# Altium project MD2084-R3M2E2.PrjPcb (part 3 of 3)

## Sheet RGB_CCM.SchDoc: =project_title
size Tabloid; PageSetup: Record=PageOptions|CenterHorizontal=True|CenterVertical=True|PrintScale=0.71|XCorrection=1.00|YCorrection=1.00|PrintKind=0|BorderSize=5000000|LeftOffset=0|BottomOffset=0|Orientation=2|PaperLength=1000|PaperWidth=1000|Scale=100|PaperSource=7|PrintQuality=-4|MediaType=1|DitherType=10|PrintScaleMode=1|PaperKind=A4; CompanyName: Luxonis Holding; DrawnBy: Martin Debevc; Organization: Luxonis Holding; Address1: 1925 Harmony Park Drive; Address2: Westminster, CO; Address3: 80234; Address4: United States; DocumentNumber: D2088000; Revision: R3M2E2; SheetNumber: 12; SheetTotal: 13
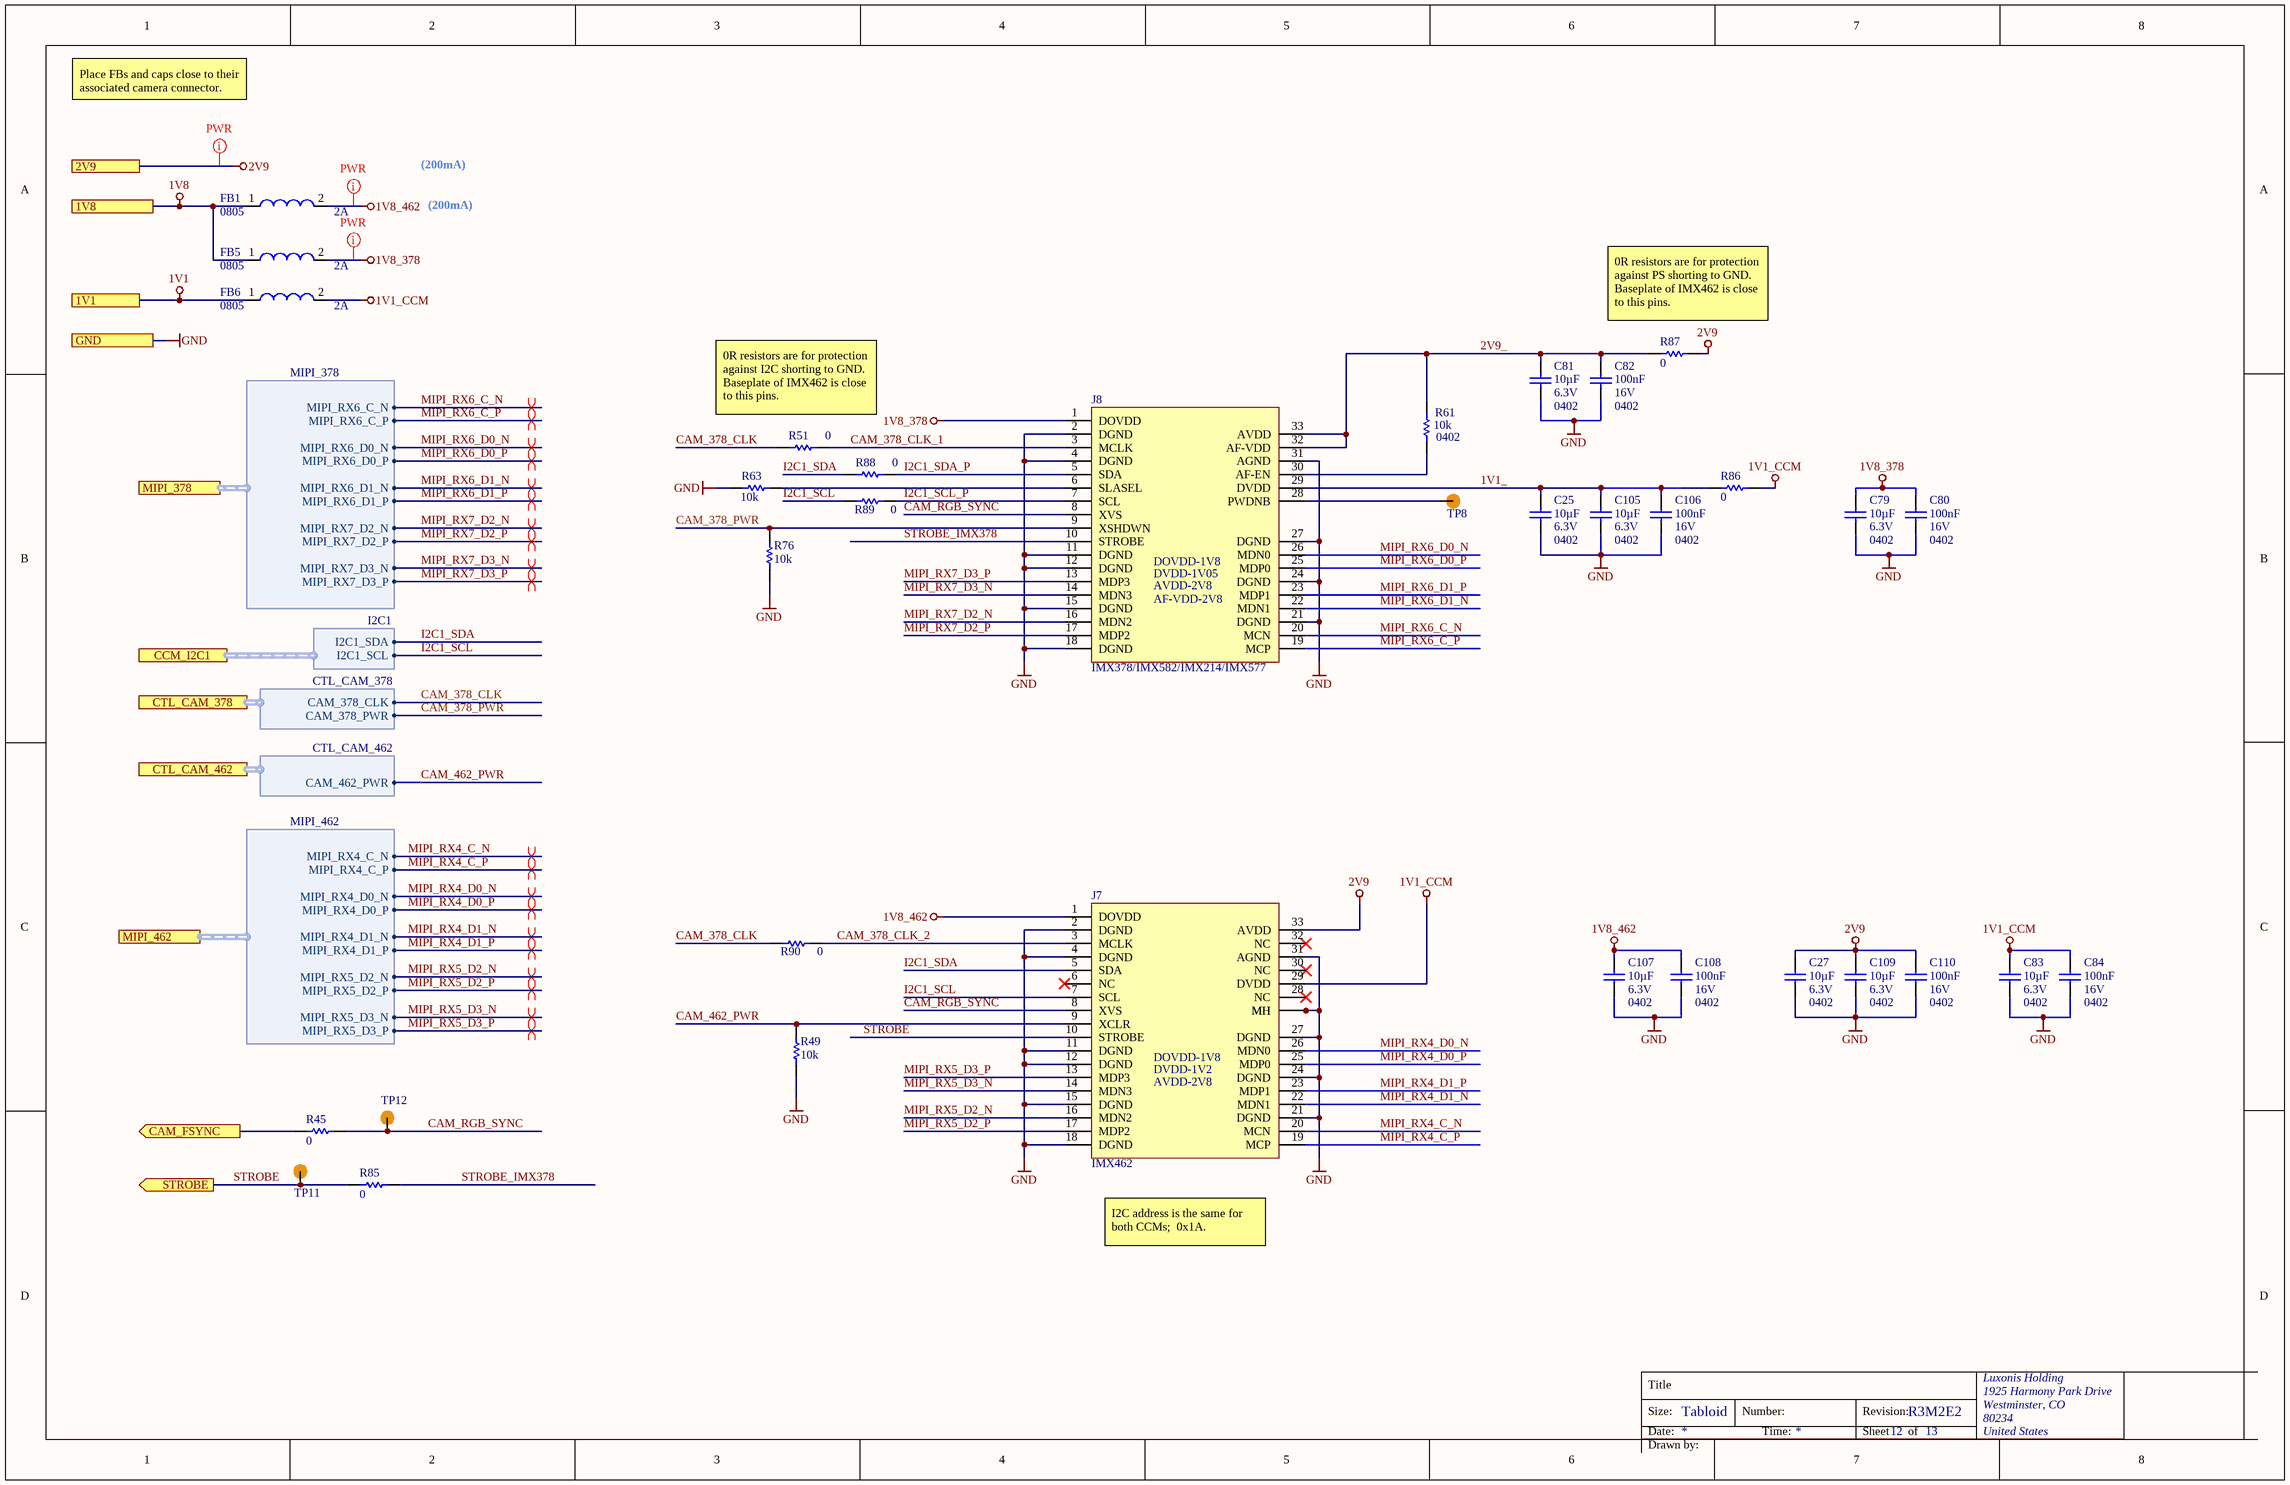
[diagram p10: RGB_CCM.SchDoc]

### Parts
C25  value 10µF  Voltage Rating: 6.3V  Case/Package: 0402  [CAPC0402(1005)70_L]  (hidden comment: GRM155R60J106ME15D)
C27  value 10µF  Voltage Rating: 6.3V  Case/Package: 0402  [CAPC0402(1005)70_L]  (hidden comment: GRM155R60J106ME15D)
C79  value 10µF  Voltage Rating: 6.3V  Case/Package: 0402  [CAPC0402(1005)70_L]  (hidden comment: GRM155R60J106ME15D)
C80  value 100nF  Voltage Rating: 16V  Case/Package: 0402  [CAPC0402(1005)60_L]  (hidden comment: CL05B104KO5NFNC)
C81  value 10µF  Voltage Rating: 6.3V  Case/Package: 0402  [CAPC0402(1005)70_L]  (hidden comment: GRM155R60J106ME15D)
C82  value 100nF  Voltage Rating: 16V  Case/Package: 0402  [CAPC0402(1005)60_L]  (hidden comment: CL05B104KO5NFNC)
C83  value 10µF  Voltage Rating: 6.3V  Case/Package: 0402  [CAPC0402(1005)70_L]  (hidden comment: GRM155R60J106ME15D)
C84  value 100nF  Voltage Rating: 16V  Case/Package: 0402  [CAPC0402(1005)60_L]  (hidden comment: CL05B104KO5NFNC)
C105  value 10µF  Voltage Rating: 6.3V  Case/Package: 0402  [CAPC0402(1005)70_L]  (hidden comment: GRM155R60J106ME15D)
C106  value 100nF  Voltage Rating: 16V  Case/Package: 0402  [CAPC0402(1005)60_L]  (hidden comment: CL05B104KO5NFNC)
C107  value 10µF  Voltage Rating: 6.3V  Case/Package: 0402  [CAPC0402(1005)70_L]  (hidden comment: GRM155R60J106ME15D)
C108  value 100nF  Voltage Rating: 16V  Case/Package: 0402  [CAPC0402(1005)60_L]  (hidden comment: CL05B104KO5NFNC)
C109  value 10µF  Voltage Rating: 6.3V  Case/Package: 0402  [CAPC0402(1005)70_L]  (hidden comment: GRM155R60J106ME15D)
C110  value 100nF  Voltage Rating: 16V  Case/Package: 0402  [CAPC0402(1005)60_L]  (hidden comment: CL05B104KO5NFNC)
FB1  Current Rating: 2A  Case/Package: 0805  [2508056017Y2]  (hidden comment: 2508056017Y2)
FB5  Current Rating: 2A  Case/Package: 0805  [2508056017Y2]  (hidden comment: 2508056017Y2)
FB6  Current Rating: 2A  Case/Package: 0805  [2508056017Y2]  (hidden comment: 2508056017Y2)
J7  IMX462  [AC_PY154-IMX462_CON]
J8  IMX378/IMX582/IMX214/IMX577  [PY004]
R45  0  [RESC0402(1005)_L]
R49  value 10k  [RESC0402(1005)_N]  (hidden comment: RC0402FR-1310KL)
R51  0  [RESC0402(1005)_L]
R61  value 10k  Case/Package: 0402  [RESC0402(1005)_N]  (hidden comment: RC0402FR-1310KL)
R63  value 10k  [RESC0402(1005)_N]  (hidden comment: RC0402FR-1310KL)
R76  value 10k  [RESC0402(1005)_N]  (hidden comment: RC0402FR-1310KL)
R85  0  [RESC0402(1005)_L]
R86  0  [RESC0402(1005)_L]
R87  0  [RESC0402(1005)_L]
R88  0  [RESC0402(1005)_L]
R89  0  [RESC0402(1005)_L]
R90  0  [RESC0402(1005)_L]
TP8  TEST_POINT  [TP075_150_NS]  (value not drawn)  (no BOM)
TP11  TEST_POINT  [TP075_150_NS]  (value not drawn)  (no BOM)
TP12  TEST_POINT  [TP075_150_NS]  (value not drawn)  (no BOM)

### Ports
1V1, 1V8, 2V9, CAM_FSYNC (out), CCM_I2C1 (harness I2C1), CTL_CAM_378 (harness CTL_CAM_378), CTL_CAM_462 (harness CTL_CAM_462), GND, MIPI_378 (harness MIPI_378), MIPI_462 (harness MIPI_462), STROBE (out)

### Harnesses
I2C1: I2C1_SDA, I2C1_SCL
CTL_CAM_462: CAM_462_PWR
CTL_CAM_378: CAM_378_CLK, CAM_378_PWR
MIPI_462: MIPI_RX4_C_N, MIPI_RX4_C_P, MIPI_RX4_D0_N, MIPI_RX4_D0_P, MIPI_RX4_D1_N, MIPI_RX4_D1_P, MIPI_RX5_D2_N, MIPI_RX5_D2_P, MIPI_RX5_D3_N, MIPI_RX5_D3_P
MIPI_378: MIPI_RX6_C_N, MIPI_RX6_C_P, MIPI_RX6_D0_N, MIPI_RX6_D0_P, MIPI_RX6_D1_N, MIPI_RX6_D1_P, MIPI_RX7_D2_N, MIPI_RX7_D2_P, MIPI_RX7_D3_N, MIPI_RX7_D3_P

### Nets
1V1: FB6.1 ; port 1V1
1V1_CCM: C83.2 C84.2 FB6.2 J7.29(DVDD) R86.1
1V8: FB1.1 FB5.1 ; port 1V8
1V8_378: C79.2 C80.2 FB5.2 J8.1(DOVDD)
1V8_462: C107.2 C108.2 FB1.2 J7.1(DOVDD)
2V9: C27.2 C109.2 C110.2 J7.33(AVDD) R87.1 ; port 2V9
GND: C25.1 C27.1 C79.1 C80.1 C81.1 C82.1 C83.1 C84.1 C105.1 C106.1 C107.1 C108.1 C109.1 C110.1 J7.2(DGND) J7.4(DGND) J7.11(DGND) J7.12(DGND) J7.15(DGND) J7.18(DGND) J7.21(DGND) J7.24(DGND) J7.27(DGND) J7.31(AGND) J7.34(MH) J7.35(MH) J8.2(DGND) J8.4(DGND) J8.11(DGND) J8.12(DGND) J8.15(DGND) J8.18(DGND) J8.21(DGND) J8.24(DGND) J8.27(DGND) J8.31(AGND) R49.2 R63.2 R76.2 ; port GND
1V1_: C25.2 C105.2 C106.2 J8.29(DVDD) R86.2
2V9_: C81.2 C82.2 J8.32(AF-VDD) J8.33(AVDD) R61.2 R87.2
CAM_378_CLK: R51.2 R90.2 ; port CTL_CAM_378.CAM_378_CLK
CAM_378_CLK_1: J8.3(MCLK) R51.1
CAM_378_CLK_2: J7.3(MCLK) R90.1
CAM_378_PWR: J8.9(XSHDWN) R76.1 ; port CTL_CAM_378.CAM_378_PWR
CAM_462_PWR: J7.9(XCLR) R49.1 ; port CTL_CAM_462.CAM_462_PWR
CAM_FSYNC: R45.2 ; port CAM_FSYNC
CAM_RGB_SYNC: J7.8(XVS) J8.8(XVS) R45.1 TP12.1
I2C1_SCL: J7.7(SCL) R89.2 ; port CCM_I2C1.I2C1_SCL
I2C1_SCL_P: J8.7(SCL) R89.1
I2C1_SDA: J7.5(SDA) R88.2 ; port CCM_I2C1.I2C1_SDA
I2C1_SDA_P: J8.5(SDA) R88.1
MIPI_RX4_C_N: J7.20(MCN) ; port MIPI_462.MIPI_RX4_C_N
MIPI_RX4_C_P: J7.19(MCP) ; port MIPI_462.MIPI_RX4_C_P
MIPI_RX4_D0_N: J7.26(MDN0) ; port MIPI_462.MIPI_RX4_D0_N
MIPI_RX4_D0_P: J7.25(MDP0) ; port MIPI_462.MIPI_RX4_D0_P
MIPI_RX4_D1_N: J7.22(MDN1) ; port MIPI_462.MIPI_RX4_D1_N
MIPI_RX4_D1_P: J7.23(MDP1) ; port MIPI_462.MIPI_RX4_D1_P
MIPI_RX5_D2_N: J7.16(MDN2) ; port MIPI_462.MIPI_RX5_D2_N
MIPI_RX5_D2_P: J7.17(MDP2) ; port MIPI_462.MIPI_RX5_D2_P
MIPI_RX5_D3_N: J7.14(MDN3) ; port MIPI_462.MIPI_RX5_D3_N
MIPI_RX5_D3_P: J7.13(MDP3) ; port MIPI_462.MIPI_RX5_D3_P
MIPI_RX6_C_N: J8.20(MCN) ; port MIPI_378.MIPI_RX6_C_N
MIPI_RX6_C_P: J8.19(MCP) ; port MIPI_378.MIPI_RX6_C_P
MIPI_RX6_D0_N: J8.26(MDN0) ; port MIPI_378.MIPI_RX6_D0_N
MIPI_RX6_D0_P: J8.25(MDP0) ; port MIPI_378.MIPI_RX6_D0_P
MIPI_RX6_D1_N: J8.22(MDN1) ; port MIPI_378.MIPI_RX6_D1_N
MIPI_RX6_D1_P: J8.23(MDP1) ; port MIPI_378.MIPI_RX6_D1_P
MIPI_RX7_D2_N: J8.16(MDN2) ; port MIPI_378.MIPI_RX7_D2_N
MIPI_RX7_D2_P: J8.17(MDP2) ; port MIPI_378.MIPI_RX7_D2_P
MIPI_RX7_D3_N: J8.14(MDN3) ; port MIPI_378.MIPI_RX7_D3_N
MIPI_RX7_D3_P: J8.13(MDP3) ; port MIPI_378.MIPI_RX7_D3_P
STROBE: J7.10(STROBE) R85.2 TP11.1 ; port STROBE
STROBE_IMX378: J8.10(STROBE) R85.1
NetJ8_6: J8.6(SLASEL) R63.1
NetJ8_28: J8.28(PWDNB) TP8.1
NetJ8_30: J8.30(AF-EN) R61.1

Not connected (* = marked no-connect by the designer): J7 6(NC)* 28(NC)* 30(NC)* 32(NC)*

### Layout directives
net class PWR; Current Rating: 200mA: 1V8_378, 1V8_462, 2V9
differential pair; differential pair class 100ohm: MIPI_RX4_C_N, MIPI_RX4_C_P, MIPI_RX4_D0_N, MIPI_RX4_D0_P, MIPI_RX4_D1_N, MIPI_RX4_D1_P, MIPI_RX5_D2_N, MIPI_RX5_D2_P, MIPI_RX5_D3_N, MIPI_RX5_D3_P, MIPI_RX6_C_N, MIPI_RX6_C_P, MIPI_RX6_D0_N, MIPI_RX6_D0_P, MIPI_RX6_D1_N, MIPI_RX6_D1_P, MIPI_RX7_D2_N, MIPI_RX7_D2_P, MIPI_RX7_D3_N, MIPI_RX7_D3_P

### Notes on the sheet
- Place FBs and caps close to their associated camera connector.
- (200mA)
- 0R resistors are for protection against PS shorting to GND. Baseplate of IMX462 is close to this pins.
- (near R51) 0R resistors are for protection against I2C shorting to GND. Baseplate of IMX462 is close to this pins.
- (near J8) (1V8)
- (near J8) (2V8)
- (near J8) (1V8 Level)
- I2C address is the same for both CCMs;  0x1A.
- Title
- Size:
- Date:
- Tabloid
- Number:
- Time:
- Revision:
- Sheet
- of
- Drawn by:
- (in symbol CMP-002-00191-10) DOVDD-1V8; DVDD-1V2; AVDD-2V8
- (in symbol CMP-005-000037-17) DOVDD-1V8; DVDD-1V05; AVDD-2V8; AF-VDD-2V8

### Library data of the parts
C25 C27 C79 C81 C83 C105 C107 C109 = CMP-004-000009-5: CAP CER 10UF 6.3V X5R 0402 20%; Manufacturer 1: Murata; Dielectric: X5R; Manufacturer Part Number 1: GRM155R60J106ME15D; ComponentLink1URL: https://www.murata.com/~/media/webrenewal/support/library/catalog/products/capacitor/mlcc/c02e.ashx?la=en-us&src-supplier=Digi-Key; Design Item ID: GRM155R60J106ME15D; Tolerance: 20%; Width: 0.02inch; Length: 0.039inch; Mounting Technology: SMT; Min Operating Temperature: -55°C; Max Operating Temperature: 85°C; ComponentLink1Description: https://www.murata.com/~/media/webrenewal/support/library/catalog/products/capacitor/mlcc/c02e.ashx?la=en-us&src-supplier=Digi-Key
C80 C82 C84 C106 C108 C110 = CMP-108-000002-6: CAP CER 0.1UF 16V X7R 0402 10%; Manufacturer 1: Samsung; ComponentLink1URL: https://datasheet.ciiva.com/25767/cl05b104ko5nfnc-25767124.pdf?src-supplier=Digi-Key; Length: 1mm; Design Item ID: CL05B104KO5NFNC; Tolerance: 10%; Min Operating Temperature: -55°C; Width: 0.02inch; Dielectric: X7R; ComponentLink1Description: https://datasheet.ciiva.com/25767/cl05b104ko5nfnc-25767124.pdf?src-supplier=Digi-Key; Height: 0.5mm; Depth: 0.5mm; Manufacturer Part Number 1: CL05B104KO5NFNC; Max Operating Temperature: 125°C; Mounting Technology: SMT
FB1 FB5 FB6 = CMP-082-000000-2: FERRITE BEAD, 0.1OHM, 2A, 0805, 600R/100MHz; Manufacturer 1: Fair-Rite; Tolerance: 25%; Manufacturer Part Number 1: 2508056017Y2
J7 = CMP-002-00191-10: FFC/FPC Connector, 33 Contact(s), 1 Row(s), Female, Right Angle, Surface Mount Terminal; Manufacturer Part Number 1: FH26W-33S-0.3SHW(60); Manufacturer 1: Hirose; ComponentLink2Description: https://www.hirose.com/product/en/download_file/key_name/FH26/category/Catalog/doc_file_id/49355/?file_category_id=4&item_id=298&is_series=1&src-supplier=Digi-Key; Pins: 33; ComponentLink3Description: https://www.hirose.com/product/download/?distributor=digikey&amp;type=2d&amp;lang=en&amp;num=FH26W-13S-0.3SHW(60)&src-supplier=Digi-Key; RoHS: Yes; ComponentLink3URL: https://www.hirose.com/product/download/?distributor=digikey&amp;type=2d&amp;lang=en&amp;num=FH26W-13S-0.3SHW(60)&src-supplier=Digi-Key; Source: LuxonisMaster.SchLib; Pricing 1: 1=1,78000, 10=1,61700, 25=1,51800, 50=1,45200, 100=1,38600, 250=1,25400, 500=1,15500, 1000=0,99000, 2500=0,92400 (USD); ComponentLink1Description: https://datasheet.ciiva.com:443/pdfs/VipMasterIC/IC/HIRO/HIRO-S-A0007913874/HIRO-S-A0008593114-1.pdf?src-supplier=IHS+Markit; ComponentLink1URL: https://datasheet.ciiva.com:443/pdfs/VipMasterIC/IC/HIRO/HIRO-S-A0007913874/HIRO-S-A0008593114-1.pdf?src-supplier=IHS+Markit; Category: FFC / FPC; Design Item ID: AC_PY111-IMX577_CON; Stock 1: 627; System: connector; ComponentLink2URL: https://www.hirose.com/product/en/download_file/key_name/FH26/category/Catalog/doc_file_id/49355/?file_category_id=4&item_id=298&is_series=1&src-supplier=Digi-Key
J8 = CMP-005-000037-17: FFC/FPC Connector, 33 Contact(s), 1 Row(s), Female, Right Angle, Surface Mount Terminal; Manufacturer Part Number 1: FH26W-33S-0.3SHW(60); Manufacturer 1: Hirose; ComponentLink3Description: https://www.hirose.com/product/download/?distributor=digikey&amp;type=2d&amp;lang=en&amp;num=FH26W-13S-0.3SHW(60)&src-supplier=Digi-Key; ComponentLink1URL: https://datasheet.ciiva.com:443/pdfs/VipMasterIC/IC/HIRO/HIRO-S-A0007913874/HIRO-S-A0008593114-1.pdf?src-supplier=IHS+Markit; Category: FFC / FPC; ComponentLink2URL: https://www.hirose.com/product/en/download_file/key_name/FH26/category/Catalog/doc_file_id/49355/?file_category_id=4&item_id=298&is_series=1&src-supplier=Digi-Key; ComponentLink1Description: https://datasheet.ciiva.com:443/pdfs/VipMasterIC/IC/HIRO/HIRO-S-A0007913874/HIRO-S-A0008593114-1.pdf?src-supplier=IHS+Markit; Pricing 1: 1=1,78000, 10=1,61700, 25=1,51800, 50=1,45200, 100=1,38600, 250=1,25400, 500=1,15500, 1000=0,99000, 2500=0,92400 (USD); ComponentLink2Description: https://www.hirose.com/product/en/download_file/key_name/FH26/category/Catalog/doc_file_id/49355/?file_category_id=4&item_id=298&is_series=1&src-supplier=Digi-Key; Source: LuxonisMaster.SchLib; Stock 1: 627; Design Item ID: AC_PY004-IMX378_CON; RoHS: Yes; Pins: 33; ComponentLink3URL: https://www.hirose.com/product/download/?distributor=digikey&amp;type=2d&amp;lang=en&amp;num=FH26W-13S-0.3SHW(60)&src-supplier=Digi-Key; System: connector
R45 R51 R85-R90 = CMP-013-000022-11: RES SMD 0 OHM 5% 1/16W 0402; Manufacturer 1: Vishay; Manufacturer Part Number 1: CRCW04020000Z0ED; Power Rating: 63mW; Voltage Rating: 50V; Case/Package: 0402; Min Operating Temperature: -55°C; Max Operating Temperature: 155°C; Tolerance: 5%; Value: 0; Design Item ID: CRCW04020000Z0ED
R49 R61 R63 R76 = CMP-115-000004-8: RES SMD 10K OHM 1% 1/16W 0402; Manufacturer 1: Yageo; Power Rating: 62.5mW; Temperature Coefficient: 100ppm/°C; Voltage Rating: 50V; Min Operating Temperature: -55°C; Max Operating Temperature: 155°C; Design Item ID: RC0402FR-1310KL; Tolerance: 1%; Manufacturer Part Number 1: RC0402FR-1310KL
  R49 R63 R76: Case/Package: 0402
TP8 TP11 TP12 = CMP-015-000000-5: Manufacturer Part Number 1: /; Design Item ID: TEST_POINT; Source: LuxonisMaster.SchLib

## Sheet IMU.SchDoc: =project_title
size Tabloid; CompanyName: Luxonis Holding; DrawnBy: Martin Debevc; Organization: Luxonis Holding; Address1: 1925 Harmony Park Drive; Address2: Westminster, CO; Address3: 80234; Address4: United States; DocumentNumber: D2088000; Revision: R3M2E2; SheetNumber: 9; SheetTotal: 13
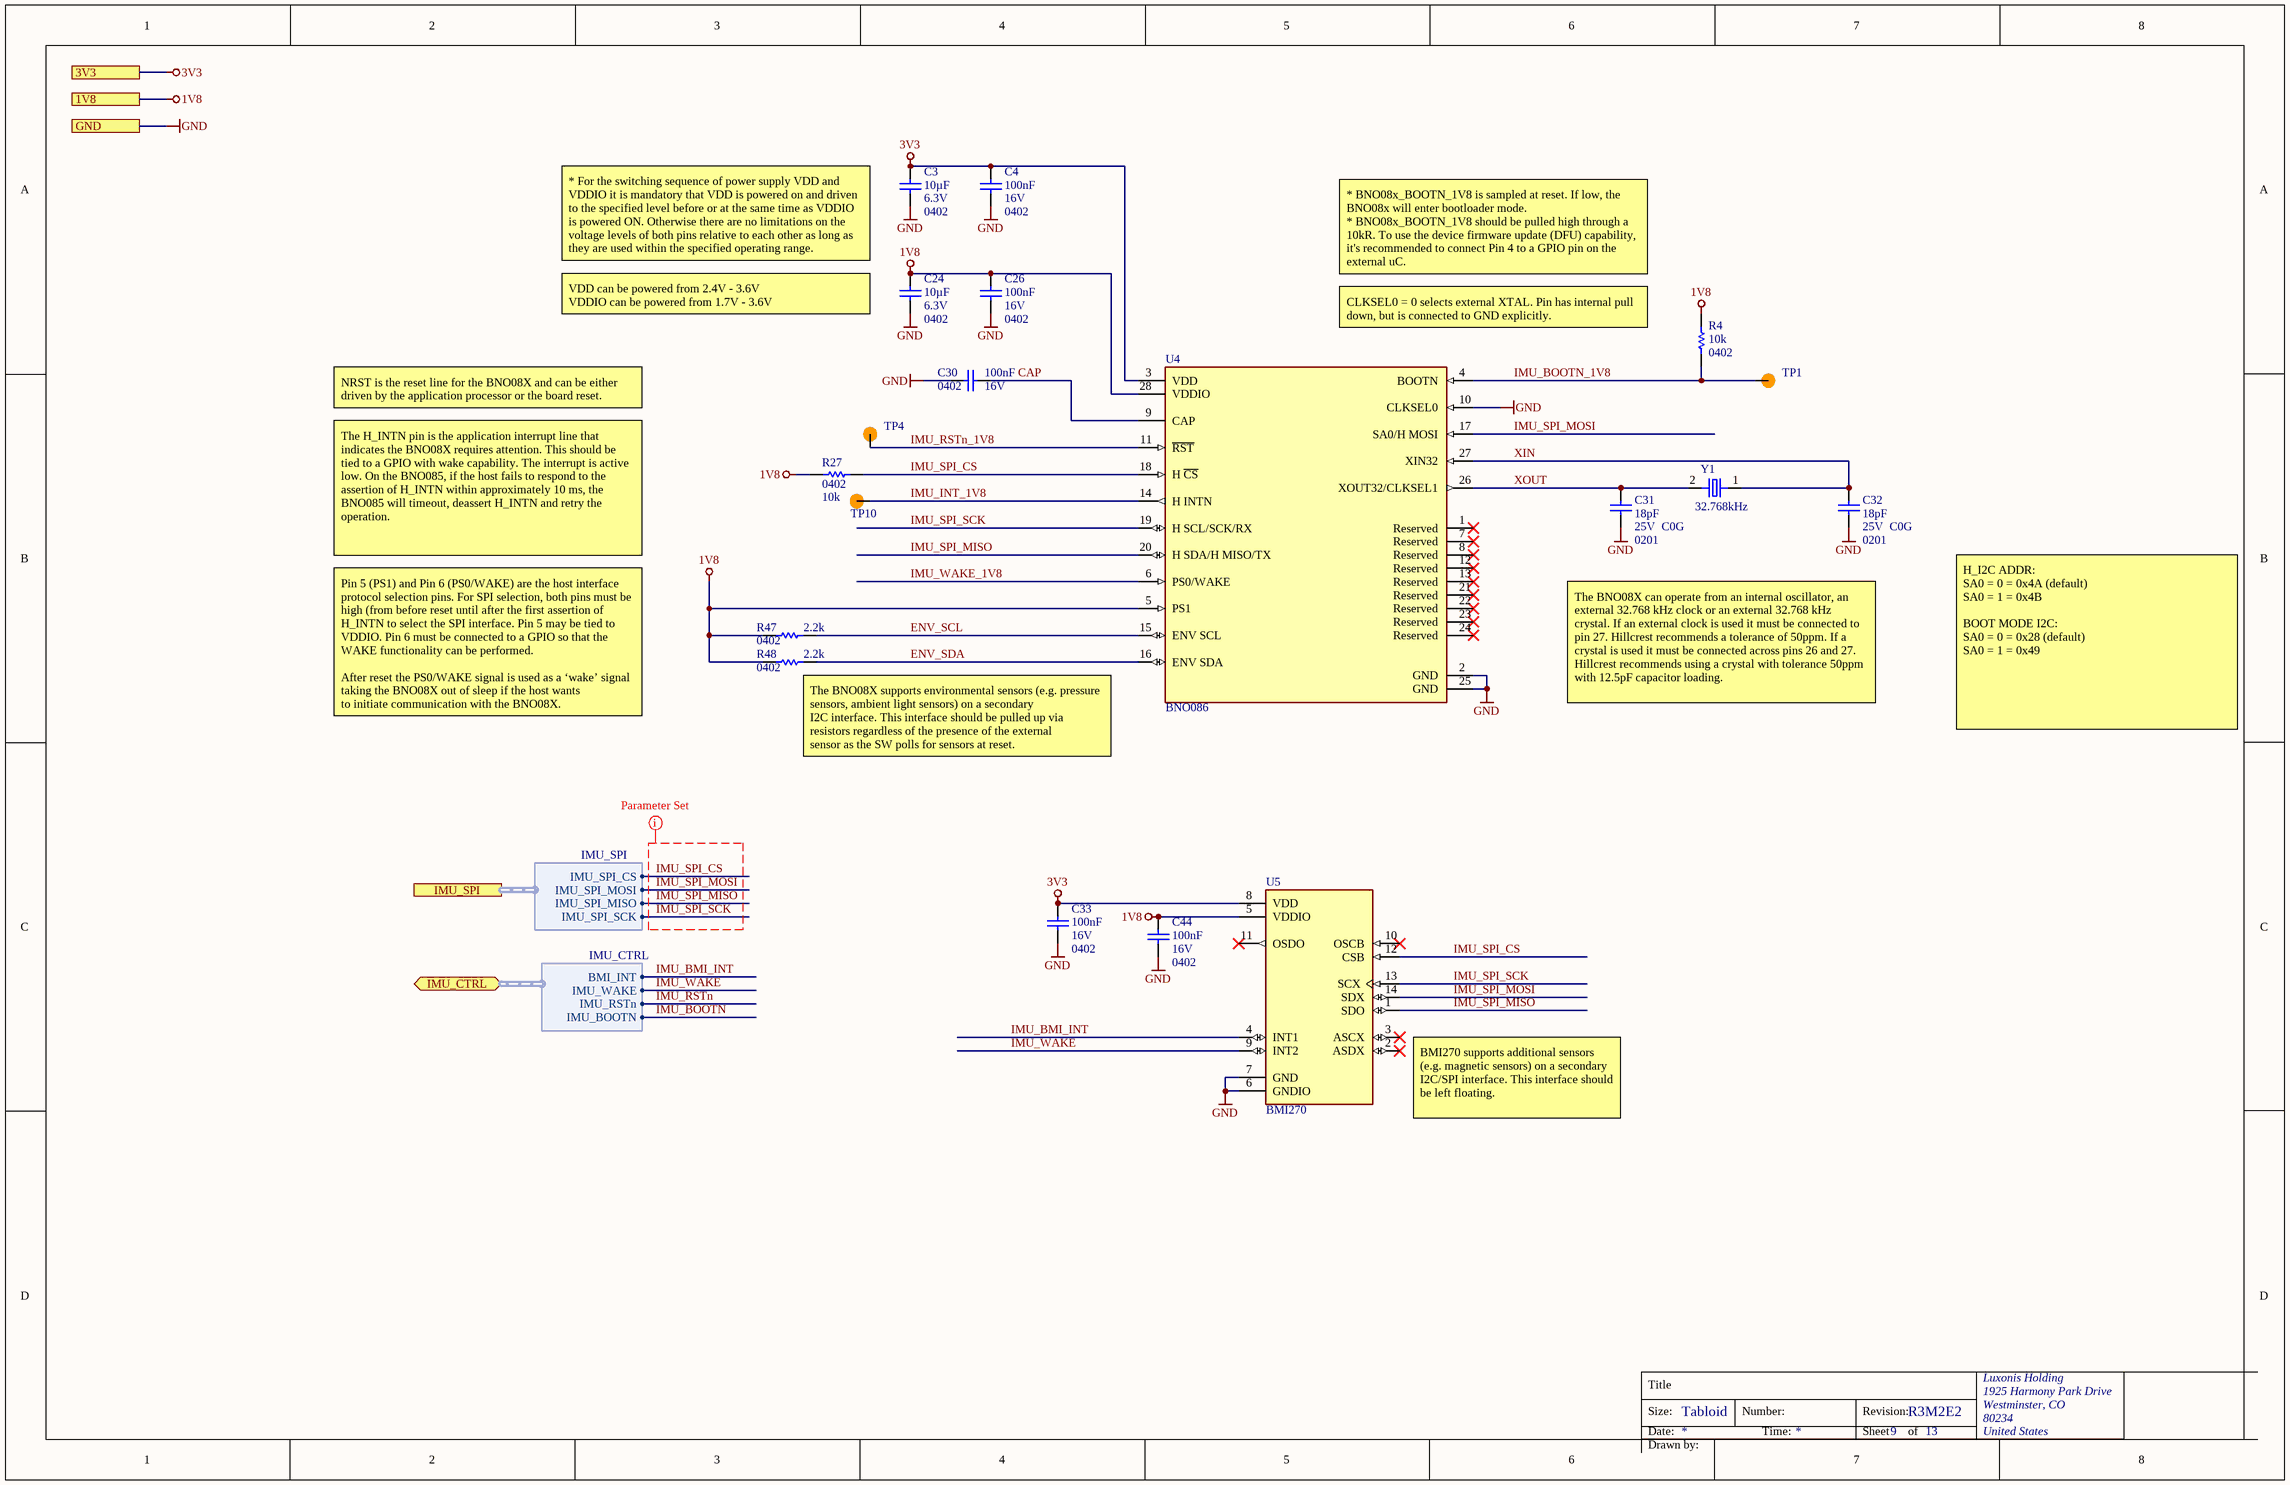
[diagram p11: IMU.SchDoc]

### Parts
C3  value 10µF  Voltage Rating: 6.3V  Case/Package: 0402  [CAPC0402(1005)70_L]  (hidden comment: GRM155R60J106ME15D)
C4  value 100nF  Voltage Rating: 16V  Case/Package: 0402  [CAPC0402(1005)60_L]  (hidden comment: CL05B104KO5NFNC)
C24  value 10µF  Voltage Rating: 6.3V  Case/Package: 0402  [CAPC0402(1005)70_L]  (hidden comment: GRM155R60J106ME15D)
C26  value 100nF  Voltage Rating: 16V  Case/Package: 0402  [CAPC0402(1005)60_L]  (hidden comment: CL05B104KO5NFNC)
C30  value 100nF  Voltage Rating: 16V  Case/Package: 0402  [CAPC0402(1005)60_L]  (hidden comment: CL05B104KO5NFNC)
C31  value 18pF  Case/Package: 0201  Voltage Rating: 25V  Dielectric: C0G  [CAPC0201(0603)33_L]  (hidden comment: GRM0335C1E180FA01D)
C32  value 18pF  Case/Package: 0201  Voltage Rating: 25V  Dielectric: C0G  [CAPC0201(0603)33_L]  (hidden comment: GRM0335C1E180FA01D)
C33  value 100nF  Voltage Rating: 16V  Case/Package: 0402  [CAPC0402(1005)60_L]  (hidden comment: CL05B104KO5NFNC)
C44  value 100nF  Voltage Rating: 16V  Case/Package: 0402  [CAPC0402(1005)60_L]  (hidden comment: CL05B104KO5NFNC)
R4  value 10k  Case/Package: 0402  [RESC0402(1005)_L]  (hidden comment: RC0402FR-1310KL)
R27  value 10k  Case/Package: 0402  [RESC0402(1005)_L]  (hidden comment: RC0402FR-1310KL)
R47  value 2.2k  Case/Package: 0402  [RESC0402(1005)_L]  (hidden comment: RC0402FR-072K2L)
R48  value 2.2k  Case/Package: 0402  [RESC0402(1005)_L]  (hidden comment: RC0402FR-072K2L)
TP1  TEST_POINT  [TP075_150_NS]  (value not drawn)  (no BOM)
TP4  TEST_POINT  [TP075_150_NS]  (value not drawn)  (no BOM)
TP10  TEST_POINT  [TP075_150_NS]  (value not drawn)  (no BOM)
U4  BNO086  [BNO086]
U5  BMI270  [XDCR_BMI270]
Y1  Frequency: 32.768kHz  [ABS06-127-32.768KHZ-T]  (hidden comment: ABS06-127-32.768KHZ-T)

### Ports
1V8, 3V3, GND, IMU_CTRL (bidir, harness IMU_CTRL), IMU_SPI (harness IMU_SPI)

### Harnesses
IMU_CTRL: BMI_INT, IMU_WAKE, IMU_RSTn, IMU_BOOTN
IMU_SPI: IMU_SPI_CS, IMU_SPI_MOSI, IMU_SPI_MISO, IMU_SPI_SCK

### Nets
1V8: C24.2 C26.2 C44.2 R4.2 R27.2 R47.1 R48.1 U4.5(PS1) U4.28(VDDIO) U5.5(VDDIO) ; port 1V8
3V3: C3.2 C4.2 C33.2 U4.3(VDD) U5.8(VDD) ; port 3V3
GND: C3.1 C4.1 C24.1 C26.1 C30.2 C31.1 C32.1 C33.1 C44.1 U4.2(GND) U4.10(CLKSEL0) U4.25(GND) U5.6(GNDIO) U5.7(GND) ; port GND
CAP: C30.1 U4.9(CAP)
ENV_SCL: R47.2 U4.15(ENV_SCL)
ENV_SDA: R48.2 U4.16(ENV_SDA)
IMU_BMI_INT: U5.4(INT1) ; port IMU_CTRL.BMI_INT
IMU_BOOTN_1V8: R4.1 TP1.1 U4.4(BOOTN)
IMU_INT_1V8: TP10.1 U4.14(H_INTN)
IMU_RSTn_1V8: TP4.1 U4.11(~{RST})
IMU_SPI_CS: R27.1 U4.18(H_~{CS}) U5.12(CSB) ; port IMU_SPI.IMU_SPI_CS
IMU_SPI_MISO: U4.20(H_SDA/H_MISO/TX) U5.1(SDO) ; port IMU_SPI.IMU_SPI_MISO
IMU_SPI_MOSI: U4.17(SA0/H_MOSI) U5.14(SDX) ; port IMU_SPI.IMU_SPI_MOSI
IMU_SPI_SCK: U4.19(H_SCL/SCK/RX) U5.13(SCX) ; port IMU_SPI.IMU_SPI_SCK
IMU_WAKE: U5.9(INT2) ; port IMU_CTRL.IMU_WAKE
IMU_WAKE_1V8: U4.6(PS0/WAKE)
XIN: C32.2 U4.27(XIN32) Y1.1
XOUT: C31.2 U4.26(XOUT32/CLKSEL1) Y1.2

Not connected (* = marked no-connect by the designer): U4 1(Reserved)* 7(Reserved)* 8(Reserved)* 12(Reserved)* 13(Reserved)* 21(Reserved)* 22(Reserved)* 23(Reserved)* 24(Reserved)*; U5 2(ASDX)* 3(ASCX)* 10(OSCB)* 11(OSDO)*

### Layout directives
net class IMU_SPI: IMU_SPI_CS, IMU_SPI_MISO, IMU_SPI_MOSI, IMU_SPI_SCK

### Notes on the sheet
- * For the switching sequence of power supply VDD and VDDIO it is mandatory that VDD is powered on and driven to the specified level before or at the same time as VDDIO is powered ON. Otherwise there are no limitations on the voltage levels of both pins relative to each other as long as they are used within the specified operating range.
- * BNO08x_BOOTN_1V8 is sampled at reset. If low, the BNO08x will enter bootloader mode.
  * BNO08x_BOOTN_1V8 should be pulled high through a 10kR. To use the device firmware update (DFU) capability, it's recommended to connect Pin 4 to a GPIO pin on the external uC.
- (near C24) VDD can be powered from 2.4V - 3.6V
  VDDIO can be powered from 1.7V - 3.6V
- CLKSEL0 = 0 selects external XTAL. Pin has internal pull down, but is connected to GND explicitly.
- NRST is the reset line for the BNO08X and can be either driven by the application processor or the board reset.
- The H_INTN pin is the application interrupt line that indicates the BNO08X requires attention. This should be tied to a GPIO with wake capability. The interrupt is active low. On the BNO085, if the host fails to respond to the assertion of H_INTN within approximately 10 ms, the BNO085 will timeout, deassert H_INTN and retry the operation.
- The BNO08X can operate from an internal oscillator, an external 32.768 kHz clock or an external 32.768 kHz crystal. If an external clock is used it must be connected to pin 27. Hillcrest recommends a tolerance of 50ppm. If a crystal is used it must be connected across pins 26 and 27. Hillcrest recommends using a crystal with tolerance 50ppm with 12.5pF capacitor loading.
- Pin 5 (PS1) and Pin 6 (PS0/WAKE) are the host interface protocol selection pins. For SPI selection, both pins must be high (from before reset until after the first assertion of H_INTN to select the SPI interface. Pin 5 may be tied to VDDIO. Pin 6 must be connected to a GPIO so that the WAKE functionality can be performed.
  After reset the PS0/WAKE signal is used as a ‘wake’ signal taking the BNO08X out of sleep if the host wants
  to initiate communication with the BNO08X.
- (near R48) The BNO08X supports environmental sensors (e.g. pressure sensors, ambient light sensors) on a secondary
  I2C interface. This interface should be pulled up via resistors regardless of the presence of the external
  sensor as the SW polls for sensors at reset.
- H_I2C ADDR:
  SA0 = 0 = 0x4A (default)
  SA0 = 1 = 0x4B
  BOOT MODE I2C:
  SA0 = 0 = 0x28 (default)
  SA0 = 1 = 0x49
- (near U5) BMI270 supports additional sensors (e.g. magnetic sensors) on a secondary I2C/SPI interface. This interface should be left floating.
- Title
- Size:
- Date:
- Tabloid
- Number:
- Time:
- Revision:
- Sheet
- of
- Drawn by:

### Library data of the parts
C3 C24 = CMP-004-000009-5: as C25 on sheet RGB_CCM; Dielectric: X5R; Manufacturer Part Number 1: GRM155R60J106ME15D; ComponentLink1URL: https://www.murata.com/~/media/webrenewal/support/library/catalog/products/capacitor/mlcc/c02e.ashx?la=en-us&src-supplier=Digi-Key; Design Item ID: GRM155R60J106ME15D; Tolerance: 20%; Width: 0.02inch; Length: 0.039inch; Mounting Technology: SMT; Min Operating Temperature: -55°C; Max Operating Temperature: 85°C; ComponentLink1Description: https://www.murata.com/~/media/webrenewal/support/library/catalog/products/capacitor/mlcc/c02e.ashx?la=en-us&src-supplier=Digi-Key
C4 C26 C30 C33 C44 = CMP-108-000002-6: as C80 on sheet RGB_CCM; ComponentLink1URL: https://datasheet.ciiva.com/25767/cl05b104ko5nfnc-25767124.pdf?src-supplier=Digi-Key; Length: 1mm; Design Item ID: CL05B104KO5NFNC; Tolerance: 10%; Min Operating Temperature: -55°C; Width: 0.02inch; Dielectric: X7R; ComponentLink1Description: https://datasheet.ciiva.com/25767/cl05b104ko5nfnc-25767124.pdf?src-supplier=Digi-Key; Height: 0.5mm; Depth: 0.5mm; Manufacturer Part Number 1: CL05B104KO5NFNC; Max Operating Temperature: 125°C; Mounting Technology: SMT
C31 C32 = CMP-004-000003-6: CAP CER 18PF 25V C0G 0201 10%; Manufacturer 1: Murata; Tolerance: 1%; Manufacturer Part Number 1: GRM0335C1E180FA01D; Min Operating Temperature: -55°C; Max Operating Temperature: 125°C; Length: 0.024inch; Height: 0.3mm; Width: 0.3mm; ComponentLink1URL: https://datasheet.ciiva.com/29538/partnumbering-e-01-29538328.pdf?src-supplier=Digi-Key; ComponentLink1Description: https://datasheet.ciiva.com/29538/partnumbering-e-01-29538328.pdf?src-supplier=Digi-Key; Design Item ID: GRM0335C1E180FA01D; Mounting Technology: SMT
R4 R27 = CMP-115-000004-8: RES SMD 10K OHM 1% 1/16W 0402; Manufacturer 1: Yageo; Temperature Coefficient: 100ppm/°C; Power Rating: 62.5mW; Voltage Rating: 50V; Manufacturer Part Number 1: RC0402FR-1310KL; Min Operating Temperature: -55°C; Max Operating Temperature: 155°C; Tolerance: 1%; Design Item ID: RC0402FR-1310KL
R47 R48 = CMP-013-000013-8: RES SMD 2.2K OHM 1% 1/16W 0402; Manufacturer 1: Yageo; Power Rating: 63mW; Voltage Rating: 50V; Manufacturer Part Number 1: RC0402FR-072K2L; Min Operating Temperature: -55°C; Max Operating Temperature: 155°C; Tolerance: 1%; Design Item ID: RC0402FR-072K2L
TP1 TP4 TP10 = CMP-015-000000-2: Manufacturer Part Number 1: /; Design Item ID: TEST_POINT; Source: LuxonisMaster.SchLib
U4 = CMP-010-00028-1: Accelerometer, Gyroscope, Magnetometer, 9 Axis Sensor I²C, SPI, UART Output; Manufacturer 1: CEVA Technologies, Inc.; Manufacturer Part Number 1: BNO086
U5 = CMP-061-000001-3: Accelerometer, Gyroscope, 6 Axis Sensor IÂ²C, SPI Output; Manufacturer 1: Bosch Sensortec; Manufacturer Part Number 1: BMI270
Y1 = CMP-006-000001-2: CRYSTAL 32.768kHz ±20ppm Crystal 12.5pF 90 kOhms 2-SMD, No Lead; Manufacturer 1: Abracon; Manufacturer Part Number 1: ABS06-127-32.768KHZ-T; Case/Package: SMD/SMT; Min Operating Temperature: -40°C; Max Operating Temperature: 85°C; Tolerance: 20ppm

## Sheet EEPROM.SchDoc: =project_title
size Tabloid; PageSetup: Record=PageOptions|CenterHorizontal=True|CenterVertical=True|PrintScale=0.73|XCorrection=1.00|YCorrection=1.00|PrintKind=0|BorderSize=5000000|LeftOffset=0|BottomOffset=0|Orientation=2|PaperLength=1000|PaperWidth=1000|Scale=100|PaperSource=7|PrintQuality=-4|MediaType=1|DitherType=10|PaperKind=A4|PrintScaleMode=1; CompanyName: Luxonis Holding; DrawnBy: Martin Debevc; Organization: Luxonis Holding; Address1: 1925 Harmony Park Drive; Address2: Westminster, CO; Address3: 80234; Address4: United States; DocumentNumber: D2088000; Revision: R3M2E2; SheetNumber: 7; SheetTotal: 14
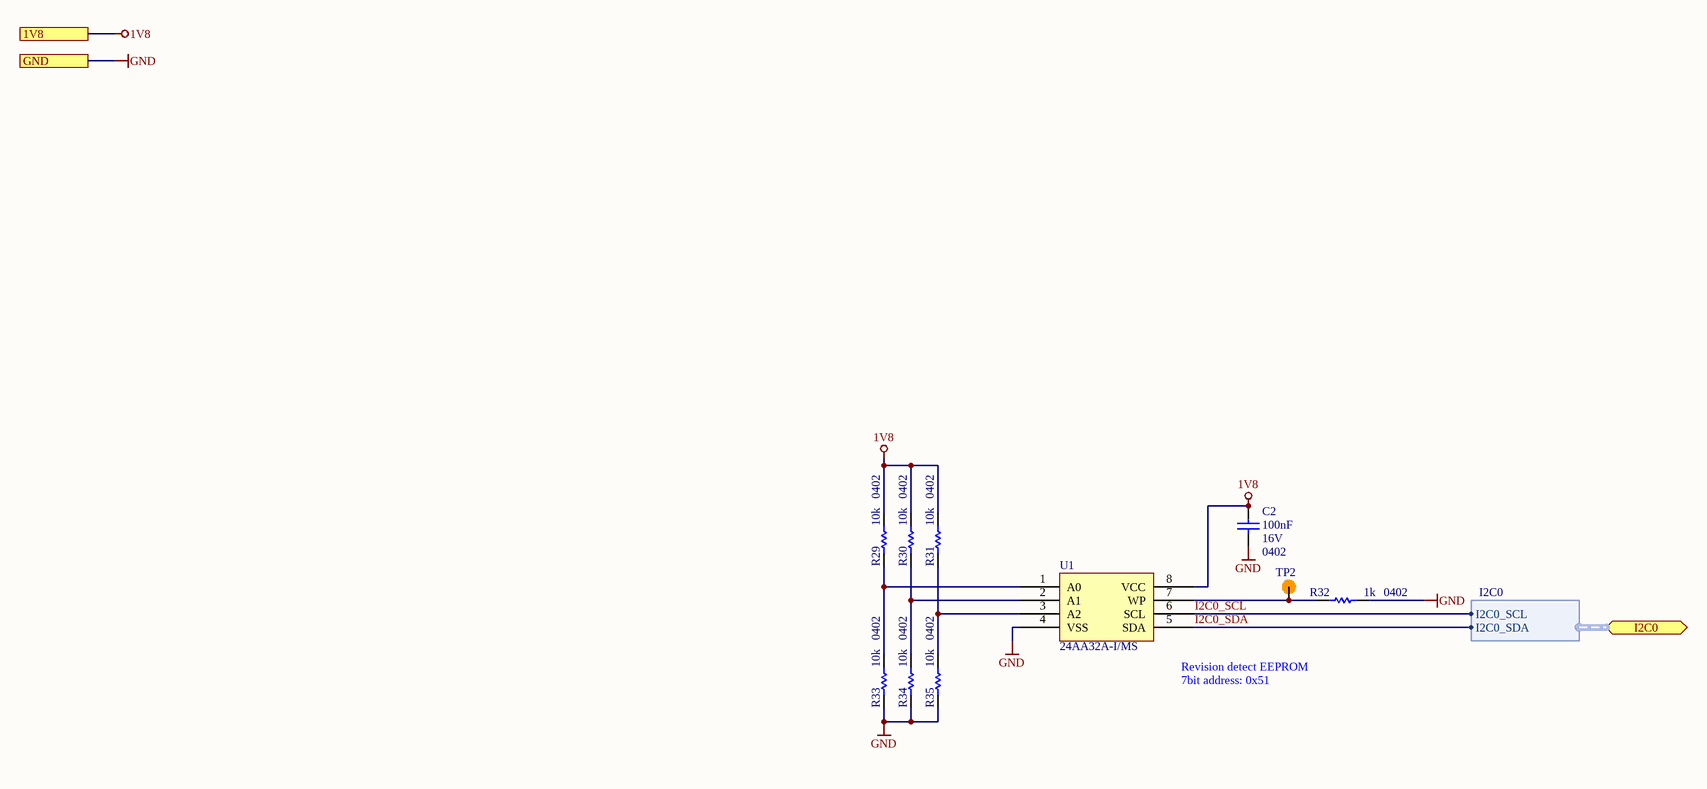
[diagram p12: EEPROM.SchDoc]

### Parts
C2  value 100nF  Voltage Rating: 16V  Case/Package: 0402  [CAPC0402(1005)60_L]  (hidden comment: CL05B104KO5NFNC)
R29  value 10k  Case/Package: 0402  [RESC0402(1005)_L]  (hidden comment: RC0402FR-1310KL)
R30  value 10k  Case/Package: 0402  [RESC0402(1005)_L]  (hidden comment: RC0402FR-1310KL)
R31  value 10k  Case/Package: 0402  [RESC0402(1005)_L]  (hidden comment: RC0402FR-1310KL)
R32  value 1k  Case/Package: 0402  [RESC0402(1005)_L]  (hidden comment: RC0402FR-071KL)
R33  value 10k  Case/Package: 0402  [RESC0402(1005)_L]  (hidden comment: RC0402FR-1310KL)
R34  value 10k  Case/Package: 0402  [RESC0402(1005)_L]  (hidden comment: RC0402FR-1310KL)
R35  value 10k  Case/Package: 0402  [RESC0402(1005)_L]  (hidden comment: RC0402FR-1310KL)
TP2  TEST_POINT  [TP075_150_NS]  (value not drawn)  (no BOM)
U1  24AA32A-I/MS  [24AA32A-I/MS]

### Ports
1V8, GND, I2C0 (bidir, harness I2C0)

### Harnesses
I2C0: I2C0_SCL, I2C0_SDA

### Nets
1V8: C2.2 R29.2 R30.2 R31.2 U1.8(VCC) ; port 1V8
GND: C2.1 R32.1 R33.1 R34.1 R35.1 U1.4(VSS) ; port GND
I2C0_SCL: U1.6(SCL) ; port I2C0.I2C0_SCL
I2C0_SDA: U1.5(SDA) ; port I2C0.I2C0_SDA
NetR29_1: R29.1 R33.2 U1.1(A0)
NetR30_1: R30.1 R34.2 U1.2(A1)
NetR31_1: R31.1 R35.2 U1.3(A2)
NetR32_2: R32.2 TP2.1 U1.7(WP)

### Notes on the sheet
- (near U1) Revision detect EEPROM
- (near U1) 7bit address: 0x51
- Title
- Size:
- Date:
- Tabloid
- Number:
- Time:
- Revision:
- Sheet
- of
- Drawn by:

### Library data of the parts
C2 = CMP-108-000002-6: as C80 on sheet RGB_CCM; ComponentLink1URL: https://datasheet.ciiva.com/25767/cl05b104ko5nfnc-25767124.pdf?src-supplier=Digi-Key; Length: 1mm; Design Item ID: CL05B104KO5NFNC; Tolerance: 10%; Min Operating Temperature: -55°C; Width: 0.02inch; Dielectric: X7R; ComponentLink1Description: https://datasheet.ciiva.com/25767/cl05b104ko5nfnc-25767124.pdf?src-supplier=Digi-Key; Height: 0.5mm; Depth: 0.5mm; Manufacturer Part Number 1: CL05B104KO5NFNC; Max Operating Temperature: 125°C; Mounting Technology: SMT
R29-R31 R33-R35 = CMP-115-000004-8: RES SMD 10K OHM 1% 1/16W 0402; Manufacturer 1: Yageo; Power Rating: 62.5mW; Voltage Rating: 50V; Temperature Coefficient: 100ppm/°C; Tolerance: 1%; Manufacturer Part Number 1: RC0402FR-1310KL; Max Operating Temperature: 155°C; Min Operating Temperature: -55°C; Design Item ID: RC0402FR-1310KL
R32 = CMP-013-000004-10: RES SMD 1K OHM 1% 1/16W 0402; Manufacturer 1: Yageo; Power Rating: 62.5mW; Voltage Rating: 50V; Min Operating Temperature: -55°C; Design Item ID: RC0402FR-071KL; Tolerance: 1%; Max Operating Temperature: 155°C; Manufacturer Part Number 1: RC0402FR-071KL
TP2 = CMP-015-000000-5: Manufacturer Part Number 1: /; Design Item ID: TEST_POINT; Source: LuxonisMaster.SchLib
U1 = CMP-010-000010-2: IC EEPROM 32K I2C 400KHZ 8MSOP Memory IC 32Kb (4K x 8) I²C 400kHz 900ns 8-MSOP; Manufacturer 1: Microchip; Case/Package: MSOP; Frequency: 400kHz; Memory Size: 32Kb; Manufacturer Part Number 1: 24AA32A-I/MS; Pins: 8

## Sheet BTB_CONN.SchDoc: =project_title
size Tabloid; CompanyName: Luxonis Holding; DrawnBy: Martin Debevc; Organization: Luxonis Holding; Address1: 1925 Harmony Park Drive; Address2: Westminster, CO; Address3: 80234; Address4: United States; DocumentNumber: D2088000; Revision: R3M2E2; SheetNumber: 4; SheetTotal: 13
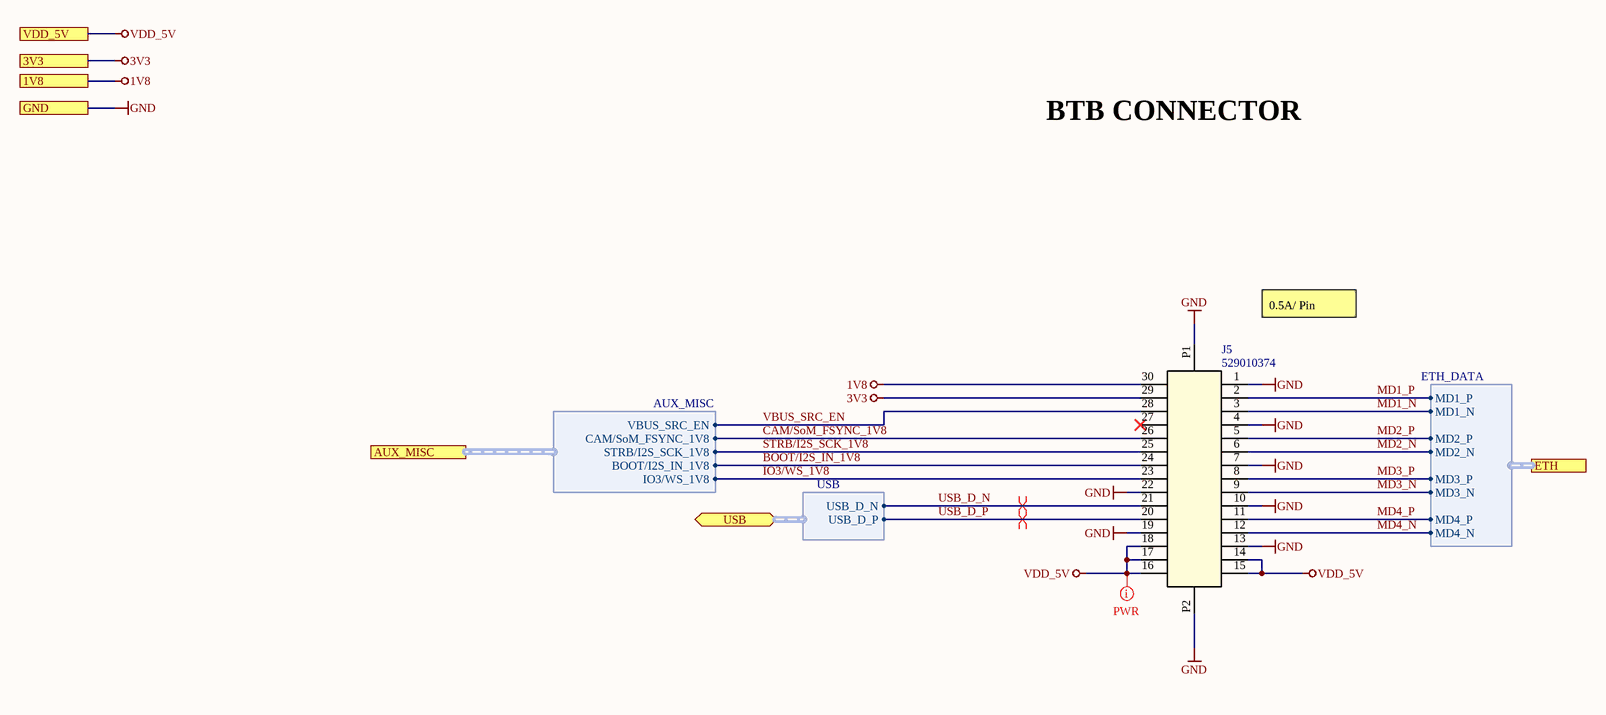
[diagram p13: BTB_CONN.SchDoc]

### Parts
J5  529010374  [CON_529010374]

### Ports
1V8, 3V3, AUX_MISC (harness AUX_MISC), ETH (harness ETH_DATA), GND, USB (bidir, harness USB), VDD_5V

### Harnesses
ETH_DATA: MD1_P, MD1_N, MD2_P, MD2_N, MD3_P, MD3_N, MD4_P, MD4_N
USB: USB_D_P, USB_D_N
AUX_MISC: VBUS_SRC_EN, CAM/SoM_FSYNC_1V8, STRB/I2S_SCK_1V8, BOOT/I2S_IN_1V8, IO3/WS_1V8

### Nets
1V8: J5.30 ; port 1V8
3V3: J5.29 ; port 3V3
GND: J5.1 J5.4 J5.7 J5.10 J5.13 J5.19 J5.22 J5.P1 J5.P2 ; port GND
VDD_5V: J5.14 J5.15 J5.16 J5.17 J5.18 ; port VDD_5V
BOOT/I2S_IN_1V8: J5.24 ; port AUX_MISC.BOOT/I2S_IN_1V8
CAM/SoM_FSYNC_1V8: J5.26 ; port AUX_MISC.CAM/SoM_FSYNC_1V8
IO3/WS_1V8: J5.23 ; port AUX_MISC.IO3/WS_1V8  [project net I2S1_WS_M8]
MD1_N: J5.3 ; port ETH.MD1_N
MD1_P: J5.2 ; port ETH.MD1_P
MD2_N: J5.6 ; port ETH.MD2_N
MD2_P: J5.5 ; port ETH.MD2_P
MD3_N: J5.9 ; port ETH.MD3_N
MD3_P: J5.8 ; port ETH.MD3_P
MD4_N: J5.12 ; port ETH.MD4_N
MD4_P: J5.11 ; port ETH.MD4_P
STRB/I2S_SCK_1V8: J5.25 ; port AUX_MISC.STRB/I2S_SCK_1V8
USB_D_N: J5.21 ; port USB.USB_D_N
USB_D_P: J5.20 ; port USB.USB_D_P
VBUS_SRC_EN: J5.28 ; port AUX_MISC.VBUS_SRC_EN

Not connected (* = marked no-connect by the designer): J5 27*

### Layout directives
differential pair; net class USB2; differential pair class 90ohm: USB_D_N, USB_D_P
net class PWR; Current Rating: 3A: VDD_5V

### Notes on the sheet
- BTB CONNECTOR
- 0.5A/ Pin
- Title
- Size:
- Date:
- Tabloid
- Number:
- Time:
- Revision:
- Sheet
- of
- Drawn by:

### Library data of the parts
J5 = CMP-002-00150-7: CONN, Board-to-Board Connector, Mezzanine, 0.635mm pitch, 2x15, 30 positions, Receptacle, Mated height 12 to 16mm; Manufacturer 1: Molex; Max Current Rating: 500mA; Voltage Rating: 100V; Connector Type: BOARD STACKING CONNECTOR; Manufacturer Part Number 1: 529010374; Mounting Technology: Board; Pins: 2x15; Max Operating Temperature: 105°C; Min Operating Temperature: -55°C; System: connector

## Sheet MIC.SchDoc: =project_title
size A4; PageSetup: Record=PageOptions|CenterHorizontal=True|CenterVertical=True|PrintScale=0.73|XCorrection=1.00|YCorrection=1.00|PrintKind=0|BorderSize=5000000|LeftOffset=0|BottomOffset=0|Orientation=2|PaperLength=1000|PaperWidth=1000|Scale=100|PaperSource=7|PrintQuality=-4|MediaType=1|DitherType=10|PaperKind=A4|PrintScaleMode=1; CompanyName: Luxonis Holding; DrawnBy: Martin Debevc; Organization: Luxonis Holding; Address1: 1925 Harmony Park Drive; Address2: Westminster, CO; Address3: 80234; Address4: United States; DocumentNumber: D2088000; Revision: R3M2E2; SheetNumber: 10; SheetTotal: 13
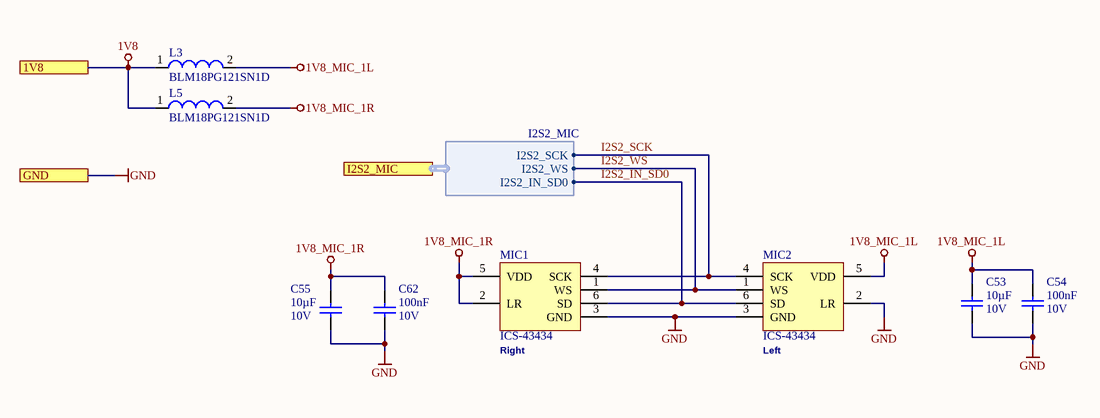
[diagram p14: MIC.SchDoc]

### Parts
C53  value 10µF  Voltage Rating: 10V  [CAPC0603(1608)100_L]  (hidden comment: GRM188R61A106ME69D)
C54  value 100nF  Voltage Rating: 10V  [CAPC0402(1005)70_L]  (hidden comment: GRM155R71A104JA01D)
C55  value 10µF  Voltage Rating: 10V  [CAPC0603(1608)100_L]  (hidden comment: GRM188R61A106ME69D)
C62  value 100nF  Voltage Rating: 10V  [CAPC0402(1005)70_L]  (hidden comment: GRM155R71A104JA01D)
L3  BLM18PG121SN1D  [BLM18PG121SN1D_N]
L5  BLM18PG121SN1D  [BLM18PG121SN1D_N]
MIC1  ICS-43434  [ICS-43434]
MIC2  ICS-43434  [ICS-43434]

### Ports
1V8, GND, I2S2_MIC (harness I2S2_MIC)

### Harnesses
I2S2_MIC: I2S2_SCK, I2S2_WS, I2S2_IN_SD0

### Nets
1V8: L3.1 L5.1 ; port 1V8
1V8_MIC_1L: C53.2 C54.2 L3.2 MIC2.5(VDD)
1V8_MIC_1R: C55.2 C62.2 L5.2 MIC1.2(LR) MIC1.5(VDD)
GND: C53.1 C54.1 C55.1 C62.1 MIC1.3(GND) MIC2.2(LR) MIC2.3(GND) ; port GND
I2S2_IN_SD0: MIC1.6(SD) MIC2.6(SD) ; port I2S2_MIC.I2S2_IN_SD0
I2S2_SCK: MIC1.4(SCK) MIC2.4(SCK) ; port I2S2_MIC.I2S2_SCK
I2S2_WS: MIC1.1(WS) MIC2.1(WS) ; port I2S2_MIC.I2S2_WS

### Notes on the sheet
- (near MIC1) Right
- (near MIC2) Left
- Title
- Size:
- Date:
- A4
- Number:
- Time:
- Revision:
- Sheet
- of
- Luxonis Holding Corporation
- 7901 Shaffer Pkwy
- Littleton, CO
- 80127 USA
- File:

### Library data of the parts
C53 C55 = CMP-004-000018-4: CAP CER 10UF 10V X5R 0603 20%; Manufacturer 1: Murata; Manufacturer Part Number 1: GRM188R61A106ME69D; Case/Package: 0603; Min Operating Temperature: -55°C; Max Operating Temperature: 85°C; Tolerance: 20%; Dielectric: X5R; Length: 1.6mm; Height: 0.8mm; Width: 0.8mm; Depth: 0.8mm; ComponentLink1URL: http://www.mouser.com/ds/2/281/c02e-2905.pdf?src-supplier=Mouser; ComponentLink1Description: http://www.mouser.com/ds/2/281/c02e-2905.pdf?src-supplier=Mouser; ComponentLink2URL: http://components.arrow.com/part/dataview/0323_06119472?src-supplier=Arrow+Europe; ComponentLink2Description: http://components.arrow.com/part/dataview/0323_06119472?src-supplier=Arrow+Europe; ComponentLink3URL: http://www.farnell.com/datasheets/2048014.pdf?src-supplier=Farnell; ComponentLink3Description: http://www.farnell.com/datasheets/2048014.pdf?src-supplier=Farnell; ComponentLink4URL: http://www.farnell.com/datasheets/1872210.pdf?src-supplier=Farnell; ComponentLink4Description: http://www.farnell.com/datasheets/1872210.pdf?src-supplier=Farnell; ComponentLink5URL: http://search.murata.co.jp/Ceramy/image/img/A01X/G101/ENG/GRM188R61A106ME69-01.pdf?src-supplier=Digi-Key; ComponentLink5Description: http://search.murata.co.jp/Ceramy/image/img/A01X/G101/ENG/GRM188R61A106ME69-01.pdf?src-supplier=Digi-Key; ComponentLink6URL: http://www.farnell.com/datasheets/1872210.pdf?src-supplier=Newark; ComponentLink6Description: http://www.farnell.com/datasheets/1872210.pdf?src-supplier=Newark; ComponentLink7URL: http://www.farnell.com/datasheets/2048014.pdf?src-supplier=Element14; ComponentLink7Description: http://www.farnell.com/datasheets/2048014.pdf?src-supplier=Element14; ComponentLink8URL: http://www.farnell.com/datasheets/2048014.pdf?src-supplier=Newark; ComponentLink8Description: http://www.farnell.com/datasheets/2048014.pdf?src-supplier=Newark; Design Item ID: GRM188R61A106ME69D; Mounting Technology: SMT
C54 C62 = CMP-108-000015-5: CAP CER 0.1UF 10V X7R 0402 5%; Manufacturer 1: Murata; Manufacturer Part Number 1: GRM155R71A104JA01D; Case/Package: 0402; Min Operating Temperature: -55°C; Max Operating Temperature: 125°C; Tolerance: 5%; Dielectric: X7R; Length: 1mm; Height: 0.5mm; Width: 0.02inch; Depth: 0.5mm; ComponentLink1URL: https://datasheet.ciiva.com/5411/product-5411135.pdf?src-supplier=Mouser; ComponentLink1Description: https://datasheet.ciiva.com/5411/product-5411135.pdf?src-supplier=Mouser; ComponentLink2URL: https://datasheet.ciiva.com/11618/c02e-11618821.pdf?src-supplier=Avnet; ComponentLink2Description: https://datasheet.ciiva.com/11618/c02e-11618821.pdf?src-supplier=Avnet; Design Item ID: GRM155R71A104JA01D; Mounting Technology: SMT
L3 L5 = CMP-009-000002-2: FERRITE BEAD 120 OHM 0603 1LN; Manufacturer 1: Murata; Tolerance: 25%; Current Rating: 2A; Manufacturer Part Number 1: BLM18PG121SN1D; Case/Package: 0603
MIC1 MIC2 = CMP-104-000003-3: 60Hz ~ 20kHz Digital, I2S Microphone MEMS _Silicon_ 1.65V ~ 3.63V Omnidirectional _-26 ±1dB @ 94dB SPL_ Solder Pads; Manufacturer 1: TDK InvenSense; Category: Microphones; Manufacturer Part Number 1: ICS-43434; Design Item ID: ICS-43434

## Nets that join several sheets
1V1: POWER_GEN (6 pins), RGB_CCM (FB6.1)
1V8: CONNECTOR_B (8 pins), CONNECTOR_A (7 pins), ETH_PCIE_CTRL (C21.2 R41.1 U7.3), BOOT_JTAG_AUX (J3.7 J6.7), POWER_GEN (R10.2 R69.2 TP9.1), Thermal_CCM (11 pins), RGB_CCM (FB1.1 FB5.1), IMU (10 pins), EEPROM (5 pins), BTB_CONN (J5.30), MIC (L3.1 L5.1)
2V9: POWER_GEN (R75.2), RGB_CCM (5 pins)
3V3: ETH_PCIE_CTRL (18 pins), BOOT_JTAG_AUX (J6.9), POWER_GEN (R66.2 TP5.1), Thermal_CCM (FB2.1 FB4.1), IMU (5 pins), BTB_CONN (J5.29)
GND: TopLevel (MH1.1 MTG1.1), CONNECTOR_B (34 pins), CONNECTOR_A (42 pins), ETH_PCIE_CTRL (26 pins), BOOT_JTAG_AUX (10 pins), POWER_GEN (22 pins), Thermal_CCM (39 pins), RGB_CCM (39 pins), IMU (14 pins), EEPROM (6 pins), BTB_CONN (9 pins), MIC (7 pins)
VDD_5V: CONNECTOR_B (10 pins), BOOT_JTAG_AUX (D3.1 J9.1 J9.2 R3.2), POWER_GEN (14 pins), Thermal_CCM (R58.1), BTB_CONN (5 pins)
BOOT0/LED_G: CONNECTOR_B (J4.26 R12.1 R21.2), BOOT_JTAG_AUX (Q4.1)
BOOT1/LED_B: CONNECTOR_B (J4.24 R13.1 R22.2), BOOT_JTAG_AUX (Q5.1)
BOOT2/LED_R: CONNECTOR_B (J4.22 R14.1 R18.1 R23.2), BOOT_JTAG_AUX (Q2.1)
BOOT/I2S_IN_1V8: CONNECTOR_A (U13.4), BTB_CONN (J5.24)
BOOT_SW: CONNECTOR_B (5 pins), CONNECTOR_A (U13.3)
CAM/SoM_FSYNC_1V8: CONNECTOR_A (U6.4), BTB_CONN (J5.26)
CAM_378_CLK: CONNECTOR_A (J2.28), RGB_CCM (R51.2 R90.2)
CAM_378_PWR: CONNECTOR_A (J2.32), RGB_CCM (J8.9 R76.1)
CAM_462_PWR: CONNECTOR_A (J2.42), RGB_CCM (J7.9 R49.1)
CAM_FSYNC: CONNECTOR_A (U6.1), BOOT_JTAG_AUX (J3.6), Thermal_CCM (Q1.2 R53.1 R73.2), RGB_CCM (R45.2)
I2C0_SCL: CONNECTOR_B (J4.34), BOOT_JTAG_AUX (J3.2), EEPROM (U1.6)
I2C0_SDA: CONNECTOR_B (J4.36), BOOT_JTAG_AUX (J3.4), EEPROM (U1.5)
I2C1_SCL: CONNECTOR_A (J2.35), Thermal_CCM (U17.5), RGB_CCM (J7.7 R89.2)
I2C1_SDA: CONNECTOR_A (J2.33), Thermal_CCM (U17.4), RGB_CCM (J7.5 R88.2)
I2C2_SCL: CONNECTOR_A (J2.79), BOOT_JTAG_AUX (J9.6)
I2C2_SDA: CONNECTOR_A (J2.77), BOOT_JTAG_AUX (J9.5)
I2S1_IN_SD0_M8: CONNECTOR_B (J4.59), CONNECTOR_A (U13.1)
I2S1_WS_M8: CONNECTOR_A (J2.80), BTB_CONN (J5.23)
I2S2_IN_SD0: CONNECTOR_B (J4.21), MIC (MIC1.6 MIC2.6)
I2S2_SCK: CONNECTOR_B (J4.17), MIC (MIC1.4 MIC2.4)
I2S2_WS: CONNECTOR_B (J4.19), MIC (MIC1.1 MIC2.1)
IMU_BMI_INT: CONNECTOR_B (R114.1), IMU (U5.4)
IMU_SPI_CS: CONNECTOR_A (J2.60), IMU (R27.1 U4.18 U5.12)
IMU_SPI_MISO: CONNECTOR_A (J2.64), IMU (U4.20 U5.1)
IMU_SPI_MOSI: CONNECTOR_A (J2.62), IMU (U4.17 U5.14)
IMU_SPI_SCK: CONNECTOR_A (J2.74), IMU (U4.19 U5.13)
IMU_WAKE: CONNECTOR_B (R108.1), IMU (U5.9)
MD1_N: ETH_PCIE_CTRL (U2.2), BTB_CONN (J5.3)
MD1_P: ETH_PCIE_CTRL (U2.1), BTB_CONN (J5.2)
MD2_N: ETH_PCIE_CTRL (U2.5), BTB_CONN (J5.6)
MD2_P: ETH_PCIE_CTRL (U2.4), BTB_CONN (J5.5)
MD3_N: ETH_PCIE_CTRL (U2.7), BTB_CONN (J5.9)
MD3_P: ETH_PCIE_CTRL (U2.6), BTB_CONN (J5.8)
MD4_N: ETH_PCIE_CTRL (U2.10), BTB_CONN (J5.12)
MD4_P: ETH_PCIE_CTRL (U2.9), BTB_CONN (J5.11)
MIPI_RX4_C_N: CONNECTOR_A (J2.3), RGB_CCM (J7.20)
MIPI_RX4_C_P: CONNECTOR_A (J2.5), RGB_CCM (J7.19)
MIPI_RX4_D0_N: CONNECTOR_A (J2.9), RGB_CCM (J7.26)
MIPI_RX4_D0_P: CONNECTOR_A (J2.11), RGB_CCM (J7.25)
MIPI_RX4_D1_N: CONNECTOR_A (J2.15), RGB_CCM (J7.22)
MIPI_RX4_D1_P: CONNECTOR_A (J2.17), RGB_CCM (J7.23)
MIPI_RX5_D2_N: CONNECTOR_A (J2.21), RGB_CCM (J7.16)
MIPI_RX5_D2_P: CONNECTOR_A (J2.23), RGB_CCM (J7.17)
MIPI_RX5_D3_N: CONNECTOR_A (J2.27), RGB_CCM (J7.14)
MIPI_RX5_D3_P: CONNECTOR_A (J2.29), RGB_CCM (J7.13)
MIPI_RX6_C_N: CONNECTOR_A (J2.4), RGB_CCM (J8.20)
MIPI_RX6_C_P: CONNECTOR_A (J2.6), RGB_CCM (J8.19)
MIPI_RX6_D0_N: CONNECTOR_A (J2.10), RGB_CCM (J8.26)
MIPI_RX6_D0_P: CONNECTOR_A (J2.12), RGB_CCM (J8.25)
MIPI_RX6_D1_N: CONNECTOR_A (J2.16), RGB_CCM (J8.22)
MIPI_RX6_D1_P: CONNECTOR_A (J2.18), RGB_CCM (J8.23)
MIPI_RX7_D2_N: CONNECTOR_A (J2.22), RGB_CCM (J8.16)
MIPI_RX7_D2_P: CONNECTOR_A (J2.24), RGB_CCM (J8.17)
MIPI_RX7_D3_N: CONNECTOR_A (J2.46), RGB_CCM (J8.14)
MIPI_RX7_D3_P: CONNECTOR_A (J2.48), RGB_CCM (J8.13)
PCIe_CLKREQ_N_1V8: CONNECTOR_B (J4.65), ETH_PCIE_CTRL (U7.4)
PCIe_ISOLATE_N_1V8: CONNECTOR_B (J4.27), ETH_PCIE_CTRL (U7.5)
PCIe_PERST_1V8: CONNECTOR_B (J4.63), ETH_PCIE_CTRL (Q3.1)
PG_3V3: CONNECTOR_A (J2.37), POWER_GEN (5 pins)
RX_DBG: CONNECTOR_B (J4.62), BOOT_JTAG_AUX (J3.3)
SDS_CLK_N: CONNECTOR_B (J4.83), ETH_PCIE_CTRL (R9.1)
SDS_CLK_P: CONNECTOR_B (J4.81), ETH_PCIE_CTRL (R8.1)
SDS_RXD_N: CONNECTOR_B (J4.77), ETH_PCIE_CTRL (C20.2)
SDS_RXD_P: CONNECTOR_B (J4.75), ETH_PCIE_CTRL (C19.2)
SDS_TXD_N: CONNECTOR_B (J4.71), ETH_PCIE_CTRL (U2.14)
SDS_TXD_P: CONNECTOR_B (J4.69), ETH_PCIE_CTRL (U2.13)
SoM_FSYNC: CONNECTOR_B (J4.44), CONNECTOR_A (U6.3)
STRB/I2S_SCK_1V8: CONNECTOR_A (U12.4), BTB_CONN (J5.25)
STROBE: CONNECTOR_B (R84.2), CONNECTOR_A (R62.1), BOOT_JTAG_AUX (J3.8 J9.7), RGB_CCM (J7.10 R85.2 TP11.1)
SYS_RST: CONNECTOR_B (J4.89), BOOT_JTAG_AUX (J6.6)
TCK: CONNECTOR_B (J4.97), BOOT_JTAG_AUX (J6.2)
TDI: CONNECTOR_B (J4.95), BOOT_JTAG_AUX (J6.3)
TDO: CONNECTOR_B (J4.91), BOOT_JTAG_AUX (J6.5)
TH_IO_1: CONNECTOR_B (J4.52), Thermal_CCM (U3.4)
TH_IO_2: CONNECTOR_B (J4.50), Thermal_CCM (U3.3)
TH_IO_3: CONNECTOR_B (J4.48), Thermal_CCM (U3.2)
TH_nRST: CONNECTOR_B (J4.54), Thermal_CCM (U3.5)
TH_RX: CONNECTOR_B (J4.74), Thermal_CCM (U9.2)
TH_SPI2_CS: CONNECTOR_A (J2.38), Thermal_CCM (J1.38)
TH_SPI2_MISO: CONNECTOR_A (J2.63), Thermal_CCM (J1.34)
TH_SPI2_MOSI: CONNECTOR_A (J2.61), Thermal_CCM (J1.37)
TH_SPI2_SCK: CONNECTOR_A (J2.40), Thermal_CCM (J1.36)
TH_TX: CONNECTOR_B (J4.72), Thermal_CCM (U9.3)
TMS: CONNECTOR_B (J4.99), BOOT_JTAG_AUX (J6.1)
TRST: CONNECTOR_B (J4.93), BOOT_JTAG_AUX (J6.4)
TX_DBG: CONNECTOR_B (J4.60), BOOT_JTAG_AUX (J3.5)
USB_D_N: CONNECTOR_B (J4.90), BTB_CONN (J5.21)
USB_D_P: CONNECTOR_B (J4.92), BTB_CONN (J5.20)
VBUS_SRC_EN: CONNECTOR_A (J2.67), BTB_CONN (J5.28)

## Assembly variants
IMX462: not fitted C25 C79 C80 C81 C82 C105 C106 FB5 J3 J8 R2 R11 R14 R15 R16 R19 R21 R22 R26 R30 R31 R33 R41 R43 R47 R50 R51 R52 R53 R61 R63 R72 R76 R77 R86 R88 R89 R? SW1; alternate parts R55 -> CMP-009-00359-2
IMX378: not fitted C27 C83 C84 C107 C108 C109 C110 FB1 J3 J7 R2 R11 R14 R15 R16 R19 R21 R22 R26 R30 R31 R33 R41 R43 R47 R49 R50 R72 R90 SW1; alternate parts R70 -> CMP-013-000014-8, R74 -> CMP-013-000008-10